# EAGLE schematic hes_wcu (EAGLE 8.2.2)
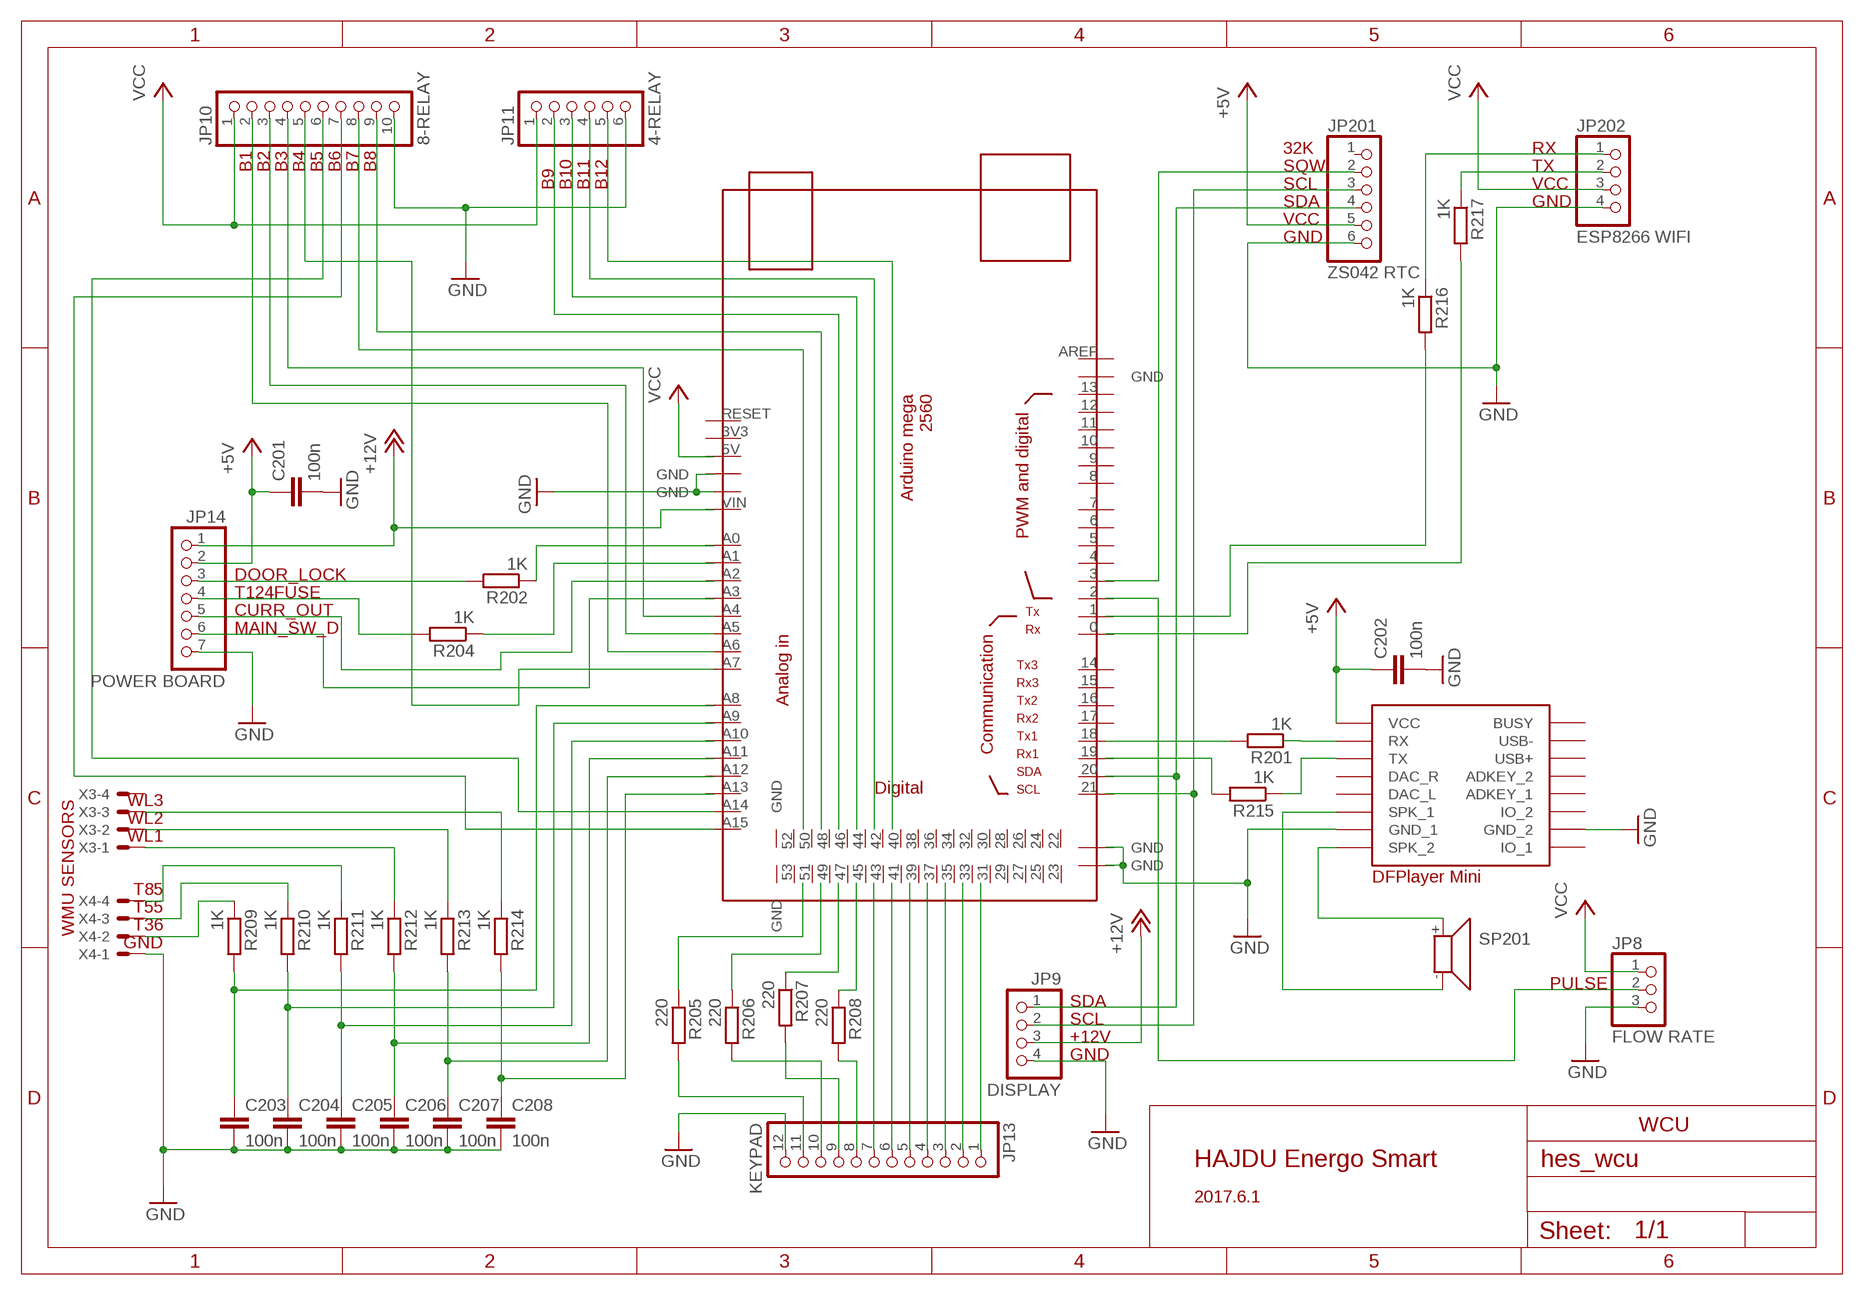
[diagram p0: schematic, sheet 1]

## Parts
C201  100n  C-EU025-024X044  [C025-024X044]
C202  100n  C-EU025-024X044  [C025-024X044]
C203  100n  C-EU025-024X044  [C025-024X044]
C204  100n  C-EU025-024X044  [C025-024X044]
C205  100n  C-EU025-024X044  [C025-024X044]
C206  100n  C-EU025-024X044  [C025-024X044]
C207  100n  C-EU025-024X044  [C025-024X044]
C208  100n  C-EU025-024X044  [C025-024X044]
JP8  FLOW RATE  PINHD-1X3  [1X03]
JP9  DISPLAY  PINHD-1X4  [1X04]
JP10  8-RELAY  PINHD-1X10  [1X10]
JP11  4-RELAY  PINHD-1X6  [1X06]
JP13  KEYPAD  PINHD-1X12  [1X12]
JP14  POWER BOARD  PINHD-1X7  [1X07]
JP201  ZS042 RTC  PINHD-1X6  [1X06]
JP202  ESP8266 WIFI  PINHD-1X4  [1X04]
R201  1K  R-EU_0204/5  [0204/5]
R202  1K  R-EU_0204/5  [0204/5]
R204  1K  R-EU_0204/5  [0204/5]
R205  220  R-EU_0204/5  [0204/5]
R206  220  R-EU_0204/5  [0204/5]
R207  220  R-EU_0204/5  [0204/5]
R208  220  R-EU_0204/5  [0204/5]
R209  1K  R-EU_0204/5  [0204/5]
R210  1K  R-EU_0204/5  [0204/5]
R211  1K  R-EU_0204/5  [0204/5]
R212  1K  R-EU_0204/5  [0204/5]
R213  1K  R-EU_0204/5  [0204/5]
R214  1K  R-EU_0204/5  [0204/5]
R215  1K  R-EU_0204/5  [0204/5]
R216  1K  R-EU_0204/5  [0204/5]
R217  1K  R-EU_0204/5  [0204/5]
SP201  SMS-1308MS-2-R  [SMS-1308MS-2-R]
U$1  MEGA_DEVICE  [MEGABOX]
U$2  DFPLAYER  [DFPLAYER]
X3  53047-04  [53047-04]
X4  53047-04  [53047-04]

## Nets
+5V: C201.1 C202.1 JP14.2 JP201.5 U$2.VCC
+12V: JP9.3 JP14.1
GND: C201.2 C202.2 C203.2 C204.2 C205.2 C206.2 C207.2 C208.2 JP8.3 JP9.4 JP10.10 JP11.6 JP13.12 JP14.7 JP201.6 JP202.4 U$2.GND_1 U$2.GND_2 X4.1
N$1: SP201.+ U$2.SPK2(SPK_2)
N$2: R209.1 X4.2
N$3: R201.2
N$4: SP201.- U$2.SPK1(SPK_1)
N$6: JP14.3 R202.2
N$7: R201.1 U$2.RX
N$8: JP14.5
N$9: JP14.4 R204.2
N$12: JP10.5
N$13: R204.1
N$14: JP14.6
N$15: JP13.11 R205.2
N$16: JP13.10 R206.2
N$17: JP13.9 R207.2
N$18: JP13.8 R208.2
N$19: R208.1
N$20: R207.1
N$21: R206.1
N$22: R205.1
N$23: JP13.7
N$24: JP13.6
N$25: JP13.5
N$26: JP13.4
N$27: JP13.3
N$28: JP13.2
N$29: JP13.1
N$30: R210.1 X4.3
N$31: C203.1 R209.2
N$32: JP8.2
N$33: C204.1 R210.2
N$34: JP9.1 JP201.4
N$35: JP9.2 JP201.3
N$36: C205.1 R211.2
N$37: C206.1 R212.2
N$38: C207.1 R213.2
N$39: C208.1 R214.2
N$40: R211.1 X4.4
N$41: R212.1 X3.1
N$42: R213.1 X3.2
N$43: R214.1 X3.3
N$45: R215.1 U$2.TX
N$46: JP10.2
N$47: JP10.3
N$48: JP10.4
N$49: JP10.7
N$50: JP10.6
N$51: JP10.8
N$52: JP10.9
N$53: JP11.2
N$54: JP11.3
N$55: JP11.4
N$56: JP11.5
N$57: R216.2
N$58: R217.2
N$59: JP201.2
N$60: JP10.1 JP11.1
N$61: JP202.2 R217.1
N$62: JP202.1 R216.1
VCC: JP8.1 JP202.3
Unconnected: JP201.1 R202.1 R215.2 U$1.0 U$1.1 U$1.2 U$1.3 U$1.3V3 U$1.4 U$1.5 U$1.5V U$1.6 U$1.7 U$1.8 U$1.9 U$1.10 U$1.11 U$1.12 U$1.13 U$1.14 U$1.15 U$1.16 U$1.17 U$1.18 U$1.19 U$1.20 U$1.21 U$1.22 U$1.23 U$1.24 U$1.25 U$1.26 U$1.27 U$1.28 U$1.29 U$1.30 U$1.31 U$1.32 U$1.33 U$1.34 U$1.35 U$1.36 U$1.37 U$1.38 U$1.39 U$1.40 U$1.41 U$1.42 U$1.43 U$1.44 U$1.45 U$1.46 U$1.47 U$1.48 U$1.49 U$1.50 U$1.51 U$1.52 U$1.53 U$1.A0 U$1.A1 U$1.A2 U$1.A3 U$1.A4 U$1.A5 U$1.A6 U$1.A7 U$1.A8 U$1.A9 U$1.A10 U$1.A11 U$1.A12 U$1.A13 U$1.A14 U$1.A15 U$1.AREF U$1.GND@1(GND) U$1.GND@2(GND) U$1.GND@3(GND) U$1.GND@4(GND) U$1.GND@5(GND) U$1.GND@6(GND) U$1.GND@7(GND) U$1.RESET U$1.VIN U$2.ADKEY1(ADKEY_1) U$2.ADKEY2(ADKEY_2) U$2.BUSY U$2.DAC_L U$2.DAC_R U$2.IO1(IO_1) U$2.IO2(IO_2) U$2.USB+ U$2.USB- X3.4

## Notes on the sheet
- 32K | RX
- B1 | B2 | B3 | B4 | B5 | B6 | B7 | B8 | SQW | TX
- B9 | B10 | B11 | B12 | SCL | VCC
- SDA | GND
- VCC
- GND
- DOOR_LOCK
- T124FUSE
- CURR_OUT
- MAIN_SW_D
- WL3
- WL2
- WL1
- T85 | DFPlayer Mini
- T55
- T36
- WMU SENSORS | GND
- PULSE
- SDA
- SCL
- +12V
- GND
- WCU
- HAJDU Energo Smart
- 2017.6.1

## Library data of the parts
C201-C208 = resistor:C-EU: CAPACITOR, European symbol
JP8 = pinhead:PINHD-1X3: PIN HEADER
JP9 JP202 = pinhead:PINHD-1X4: PIN HEADER
JP10 = pinhead:PINHD-1X10: PIN HEADER
JP11 JP201 = pinhead:PINHD-1X6: PIN HEADER
JP13 = pinhead:PINHD-1X12: PIN HEADER
JP14 = pinhead:PINHD-1X7: PIN HEADER
R201 R202 R204-R217 = resistor:R-EU_: RESISTOR, European symbol
SP201 = speaker:SMS-1308MS-2-R: Speaker 13 x 13mm, 8 Ohm, 0.7W Source: pui audio inc. SMS-1308MS-2-R.pdf
U$1 = ArduinoMegaSymbol:MEGA_DEVICE: mega card as device
U$2 = DFPlayer_v1:DFPLAYER
X3 X4 = con-molex:53?-04: CONNECTOR wire to board 1.25 mm (.049 inch) pitch header; MF: WALDOM/MOLEX; MPN: 53047-0410; OC_FARNELL: 9733060; OC_NEWARK: 38C9900